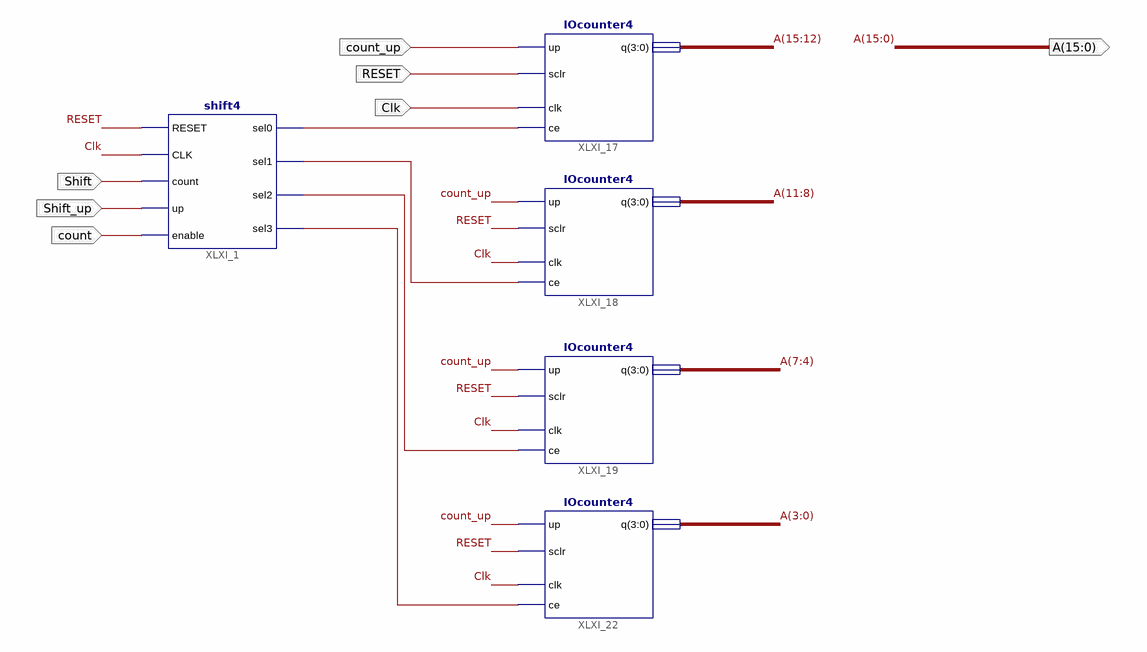
[diagram p0: schematic sheet 1]
// Xilinx ISE schematic RotaryInputControl.sch (spartan3e) as structural Verilog: 5 symbols, 7 ports
module RotaryInputControl (
  input  count_up,
  input  count,
  input  Shift_up,
  input  Shift,
  input  RESET,
  input  Clk,
  output [15:0] A
);

  wire XLXN_28, XLXN_42, XLXN_43, XLXN_44;

  shift4 XLXI_1 (
    .RESET(RESET), .CLK(Clk), .count(Shift), .up(Shift_up), .enable(count), .sel0(XLXN_28), .sel1(XLXN_42),
    .sel2(XLXN_43), .sel3(XLXN_44));
  IOcounter4 XLXI_17 (.q(A[15:12]), .ce(XLXN_28), .clk(Clk), .sclr(RESET), .up(count_up));
  IOcounter4 XLXI_18 (.q(A[11:8]), .ce(XLXN_42), .clk(Clk), .sclr(RESET), .up(count_up));
  IOcounter4 XLXI_19 (.q(A[7:4]), .ce(XLXN_43), .clk(Clk), .sclr(RESET), .up(count_up));
  IOcounter4 XLXI_22 (.q(A[3:0]), .ce(XLXN_44), .clk(Clk), .sclr(RESET), .up(count_up));
endmodule
